# Altium schematic sheet AccBottom.SchDoc
size D; SheetNumber: 1; SheetTotal: 1
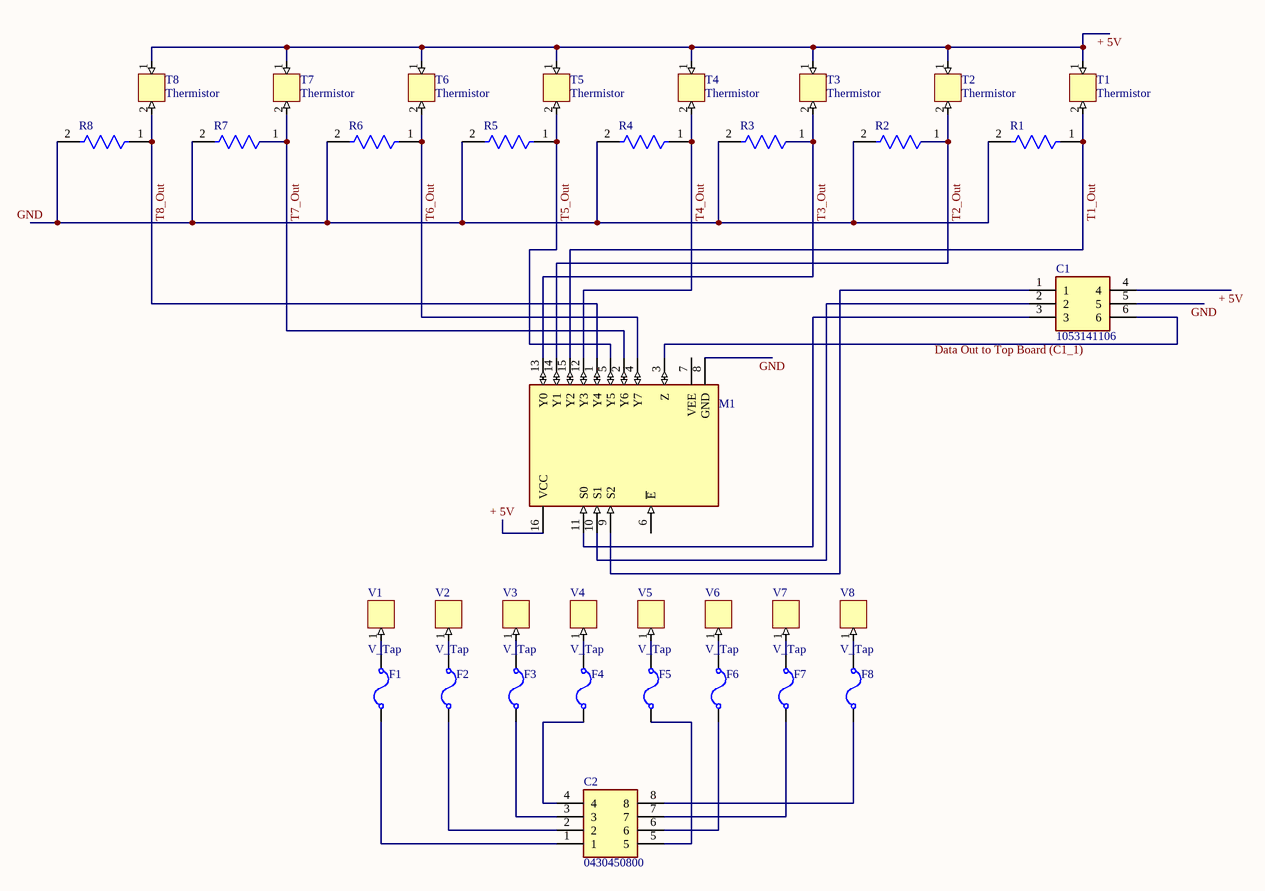
[diagram p0: AccBottom.SchDoc]

## Parts
C1  1053141106  [6 Pin Dual Nano]
C2  0430450800  [8 Pin Dual]
F1  0ACG-1000-TE  [Fuse]  (value not drawn)
F2  0ACG-1000-TE  [Fuse]  (value not drawn)
F3  0ACG-1000-TE  [Fuse]  (value not drawn)
F4  0ACG-1000-TE  [Fuse]  (value not drawn)
F5  0ACG-1000-TE  [Fuse]  (value not drawn)
F6  0ACG-1000-TE  [Fuse]  (value not drawn)
F7  0ACG-1000-TE  [Fuse]  (value not drawn)
F8  0ACG-1000-TE  [Fuse]  (value not drawn)
M1  74HC4051D,653  [8x1MUX]  (value not drawn)
R1  RC0805FR-133K3L  [3.3kRes]  (value not drawn)
R2  RC0805FR-133K3L  [3.3kRes]  (value not drawn)
R3  RC0805FR-133K3L  [3.3kRes]  (value not drawn)
R4  RC0805FR-133K3L  [3.3kRes]  (value not drawn)
R5  RC0805FR-133K3L  [3.3kRes]  (value not drawn)
R6  RC0805FR-133K3L  [3.3kRes]  (value not drawn)
R7  RC0805FR-133K3L  [3.3kRes]  (value not drawn)
R8  RC0805FR-133K3L  [3.3kRes]  (value not drawn)
T1  Thermistor  [Thermistor]  (no BOM)
T2  Thermistor  [Thermistor]  (no BOM)
T3  Thermistor  [Thermistor]  (no BOM)
T4  Thermistor  [Thermistor]  (no BOM)
T5  Thermistor  [Thermistor]  (no BOM)
T6  Thermistor  [Thermistor]  (no BOM)
T7  Thermistor  [Thermistor]  (no BOM)
T8  Thermistor  [Thermistor]  (no BOM)
V1  V_Tap  [Voltage tap]  (no BOM)
V2  V_Tap  [Voltage tap]  (no BOM)
V3  V_Tap  [Voltage tap]  (no BOM)
V4  V_Tap  [Voltage tap]  (no BOM)
V5  V_Tap  [Voltage tap]  (no BOM)
V6  V_Tap  [Voltage tap]  (no BOM)
V7  V_Tap  [Voltage tap]  (no BOM)
V8  V_Tap  [Voltage tap]  (no BOM)

## Nets
+ 5V: C1.4 M1.16(VCC) T1.1 T2.1 T3.1 T4.1 T5.1 T6.1 T7.1 T8.1
GND: C1.5 M1.8(GND) R1.2 R2.2 R3.2 R4.2 R5.2 R6.2 R7.2 R8.2
T1_Out: M1.15(Y2) R1.1 T1.2
T2_Out: M1.14(Y1) R2.1 T2.2
T3_Out: M1.13(Y0) R3.1 T3.2
T4_Out: M1.12(Y3) R4.1 T4.2
T5_Out: M1.5(Y5) R5.1 T5.2
T6_Out: M1.4(Y7) R6.1 T6.2
T7_Out: M1.2(Y6) R7.1 T7.2
T8_Out: M1.1(Y4) R8.1 T8.2
NetC1_1: C1.1 M1.9(S2)
NetC1_2: C1.2 M1.10(S1)
NetC1_3: C1.3 M1.11(S0)
NetC1_6: C1.6 M1.3(Z)
NetC2_1: C2.1 F1.1(PB6)
NetC2_2: C2.2 F2.1(PB6)
NetC2_3: C2.3 F3.1(PB6)
NetC2_4: C2.4 F4.1(PB6)
NetC2_5: C2.5 F5.1(PB6)
NetC2_6: C2.6 F6.1(PB6)
NetC2_7: C2.7 F7.1(PB6)
NetC2_8: C2.8 F8.1(PB6)
NetF1_2: F1.2(PB6) V1.1
NetF2_2: F2.2(PB6) V2.1
NetF3_2: F3.2(PB6) V3.1
NetF4_2: F4.2(PB6) V4.1
NetF5_2: F5.2(PB6) V5.1
NetF6_2: F6.2(PB6) V6.1
NetF7_2: F7.2(PB6) V7.1
NetF8_2: F8.2(PB6) V8.1

Not connected (* = marked no-connect by the designer): M1 6(~{E}) 7(VEE)

## Notes on the sheet
- Labels drawn without touching a wire or pin: Data Out to Top Board (C1_1)

## Library data of the parts
C1 = 1053141106: Nano-Fit Right-Angle Header, Through Hole, 2.50mm Pitch, Dual Row, 6 Circuits, Glow-Wire Capable, Tray; Manufacturer_Name: Molex; Geometry.Height: 9.14mm; Manufacturer_Part_Number: 1053141106; Mouser Part Number: *; Mouser Price/Stock: *; Arrow Part Number: 1053141106; Arrow Price/Stock: https://www.arrow.com/en/products/1053141106/molex?region=europe; Datasheet Link: https://www.molex.com/pdm_docs/sd/1053141104_sd.pdf
C2 = 0430450800: Micro-Fit (3.0) dual row, right angle, thru hole header; Manufacturer_Name: Molex; Manufacturer_Part_Number: 0430450800; Mouser Part Number: N/A; Mouser Price/Stock: https://www.mouser.co.uk/ProductDetail/Molex/0430450800?qs=PBcRNPEHKsoGHBzIT0cB6w%3D%3D; Arrow Part Number: 0430450800; Arrow Price/Stock: https://www.arrow.com/en/products/0430450800/molex; Datasheet Link: http://www.molex.com/pdm_docs/sd/430450800_sd.pdf
F1-F8 = 0ACG-1000-TE: Electric Fuse, 1A, 350VAC, 500VDC, 100A (IR), Surface Mount; Manufacturer: Bel; Supplier: Newark; Supplier Part Number: 71AJ7068; Manufacturer Part Number: 0ACG-1000-TE; RoHS: Yes; Category: Fuses; Stock: 965; Pricing: 1=3.46000, 10=3.34000, 25=2.98000, 50=2.62000, 100=2.14000, 250=2.08000 (USD)
M1 = 74HC4051D: IC MUX/DEMUX 8X1 16SOIC
R1-R8 = RC0805FR-133K3L: Fixed Resistor, Metal Glaze/thick Film, 0.125W, 3300ohm, 150V, 1% +/-Tol, 100ppm/Cel, Surface Mount, 0805; Manufacturer: KOA Speer; Manufacturer Part Number: RK73G2ATTD3301F; Resistance: 3.3kR; Power Rating: 125mW; Temperature Coefficient: 50ppm/°C; Additional Feature: HIGH PRECISION; Rated Temperature: 70°C; Value: 3.3kR; Package Height: 0.5mm; Package Length: 2mm; Package Width: 1.25mm; Reference Standard: AEC-Q200; Construction: Rectangular; Length: 2mm; Termination: SMD/SMT; Military Standard: Not; Series: RK73G; Case/Package: 0805; Depth: 1.25mm; Voltage Rating: 150V; Packaging: Tape and Reel; Case Code (Imperial): 0805; Max Operating Temperature: 125°C; Tolerance: 1%; Case Code (Metric): 2012; Resistor Type: Thick Film; Min Operating Temperature: -55°C; RoHS Compliant: Yes; Supplier: Arrow Electronics; Supplier Part Number: RK73G2ATTD3301F; RoHS: Yes; Category: Chip SMD Resistors; Stock: 4469; Pricing: 1=0.2602, 10=0.219, 25=0.2168, 100=0.0859, 250=0.0829, 500=0.0771, 1000=0.0463, 3000=0.0331 (USD); Mounting Technology: Surface Mount; Pins: 2; Terminal Finish: Nickel; JESD-609 Code: e3; Package Style: SMTMeter; Power: 125mW; Technology: THICK FILM/METAL GLAZE; Working Voltage: 150V; Reach SVHC Compliant: Yes; ComponentLink1URL: https://datasheet.ciiva.com:443/pdfs/VipMasterIC/IC/KOAS/KOAS-S-A0009827357/KOAS-S-A0009827357-1.pdf?src-supplier=IHS+Markit; ComponentLink1Description: https://datasheet.ciiva.com:443/pdfs/VipMasterIC/IC/KOAS/KOAS-S-A0009827357/KOAS-S-A0009827357-1.pdf?src-supplier=IHS+Markit; ComponentLink2URL: https://datasheet.ciiva.com/5554/rk73g-5554844.pdf?src-supplier=Mouser; ComponentLink2Description: https://datasheet.ciiva.com/5554/rk73g-5554844.pdf?src-supplier=Mouser; Package Shape: Rectangular; ComponentLink3URL: https://datasheet.ciiva.com:443/pdfs/VipMasterIC/IC/YAGO/YAGO-S-A0008145938/YAGO-S-A0008145938-1.pdf?src-supplier=IHS+Markit; ComponentLink3Description: https://datasheet.ciiva.com:443/pdfs/VipMasterIC/IC/YAGO/YAGO-S-A0008145938/YAGO-S-A0008145938-1.pdf?src-supplier=IHS+Markit; ComponentLink4URL: http://www.mouser.com/ds/2/447/Yageo_08112016_RC0805-968729.pdf?src-supplier=Mouser; ComponentLink4Description: http://www.mouser.com/ds/2/447/Yageo_08112016_RC0805-968729.pdf?src-supplier=Mouser; ComponentLink5URL: http://www.yageo.com/pdf/PYu-RC0805_51_RoHS_L_4.pdf?src-supplier=Avnet; ComponentLink5Description: http://www.yageo.com/pdf/PYu-RC0805_51_RoHS_L_4.pdf?src-supplier=Avnet; Supplier 1: Future Electronics; Supplier Part Number 1: 3067720